# EasyEDA Pro project F103_RGB.eprj, board PCB1
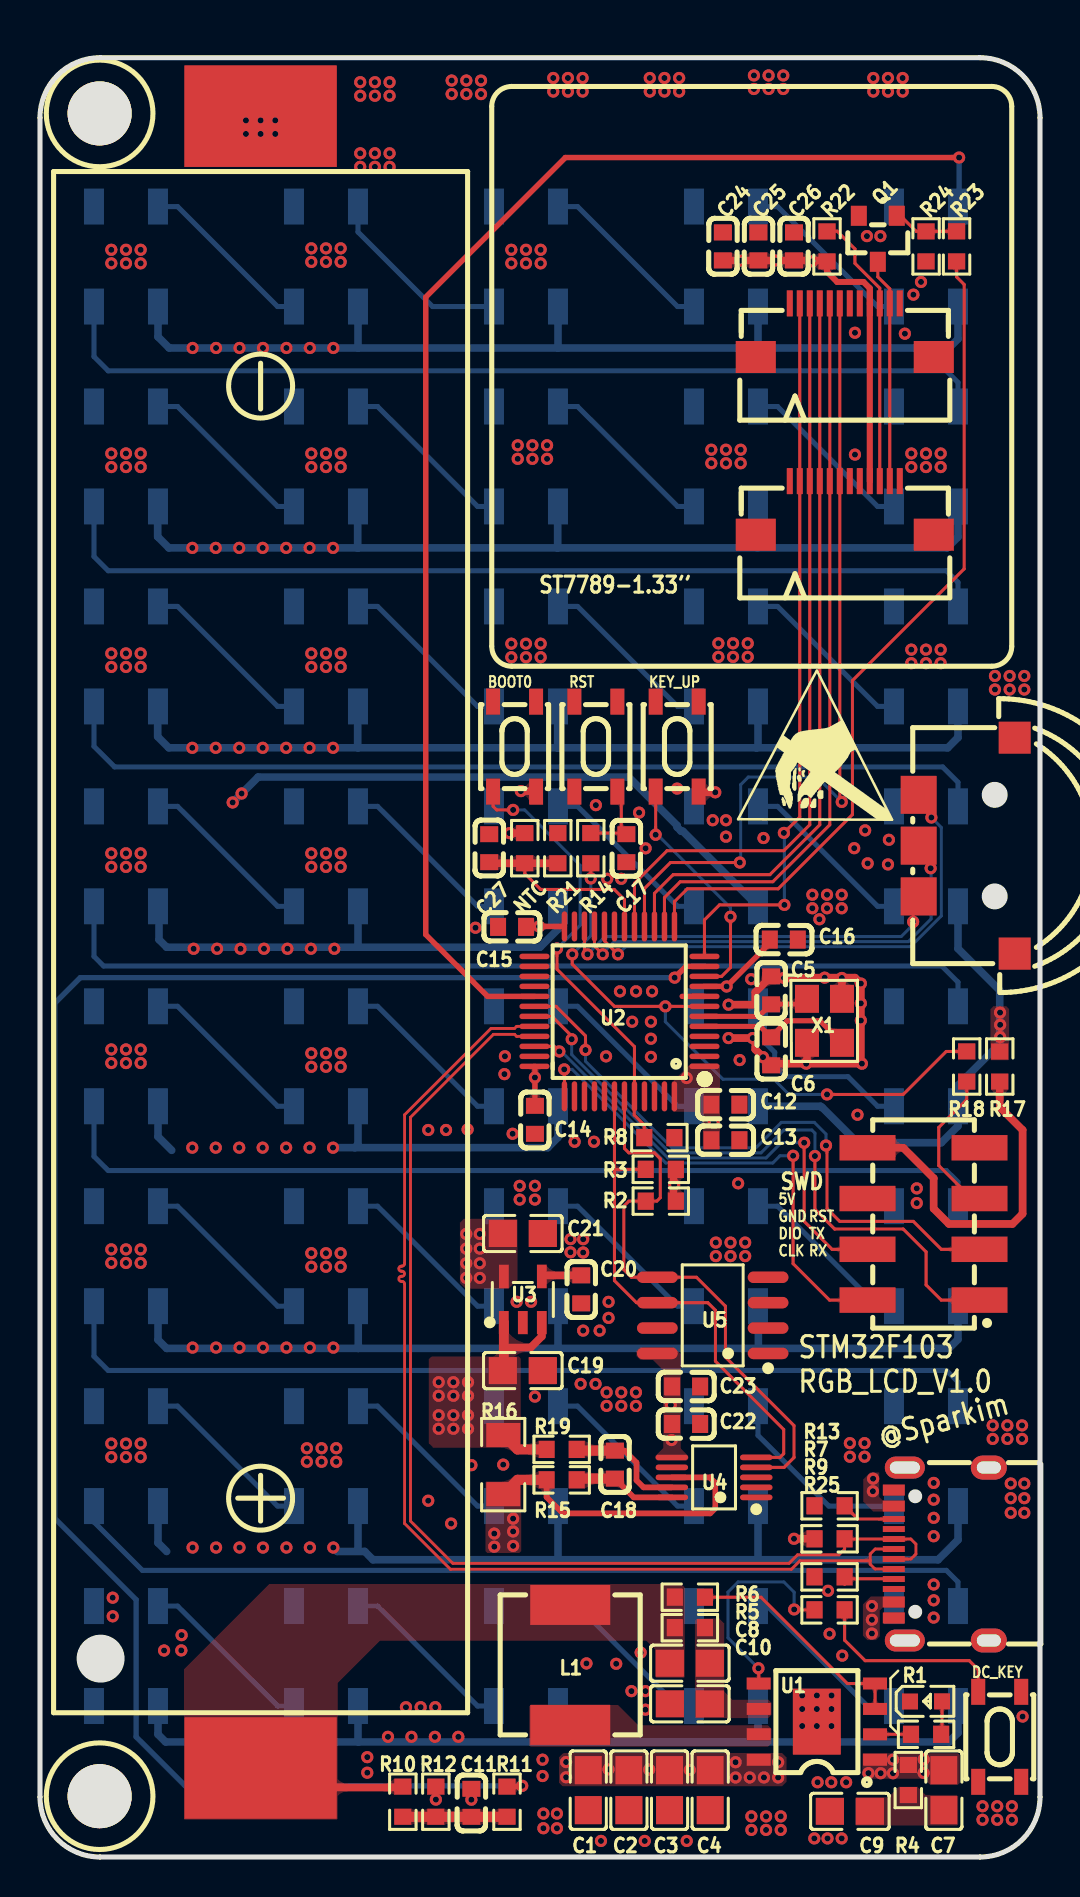
[diagram p1: board, top side]
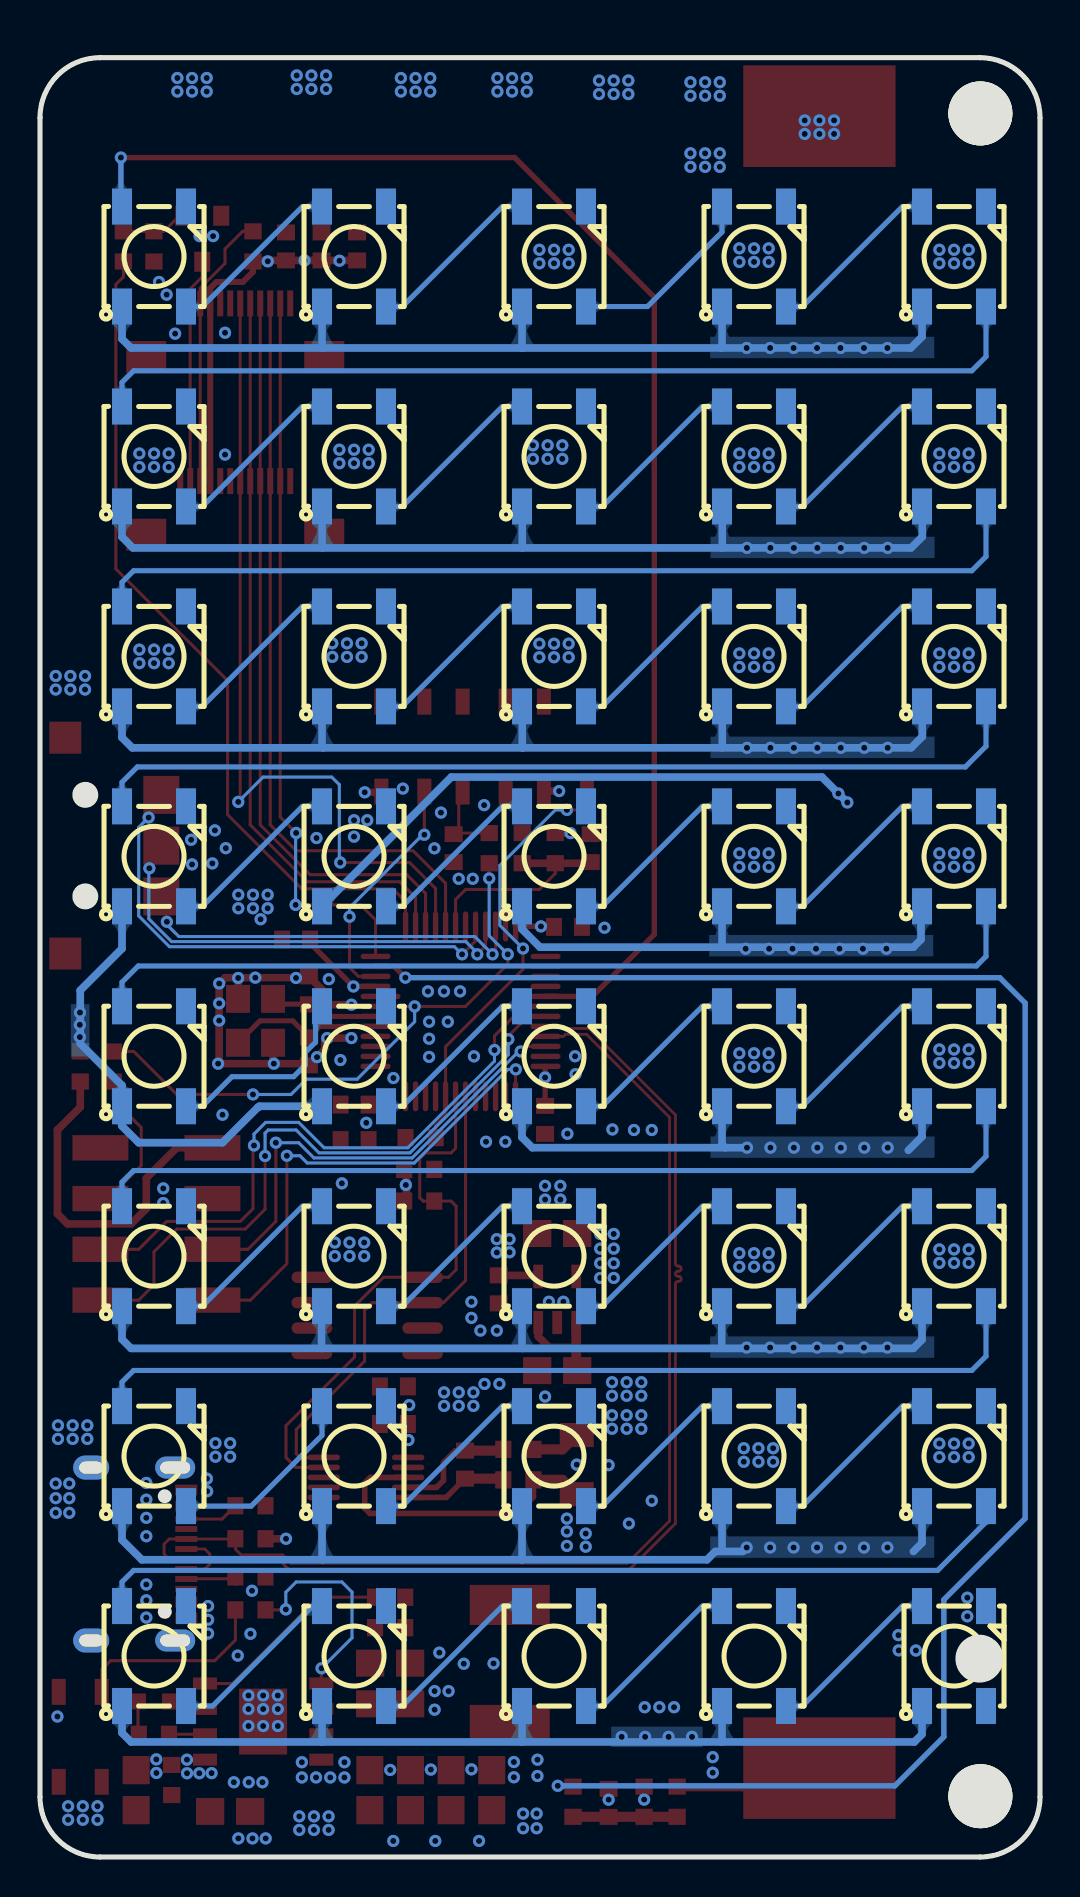
[diagram p2: board, bottom side, seen from below]

Outline 50 x 90 mm; copper layers: Top Layer, Inner1, Inner2, Bottom Layer. Coordinates in mm from the lower left corner of the outline.
Outline path: 0,87 0,3 arc(0.88,0.88) 3,0 47,0 arc(49.12,0.88) 50,3 50,87 arc(49.12,89.12) 47,90 3,90 arc(0.88,89.12) 0,87
Stack: Top Layer 0.035mm 外层铜厚1oz / Dielectric1 0.2104mm 7628 RC49% 8.6mil / Inner1 0.0152mm 内层铜厚 / Dielectric2 1.065mm 1.1mm H/HOZ Copper / Inner2 0.0152mm 内层铜厚 / Dielectric3 0.2104mm 7628 RC49% 8.6mil / Bottom Layer 0.035mm 外层铜厚1oz

## Design rules (mm)
net USB_DM: USB
net USB_DP: USB
template: 自定义配置
spacing copperThickness1oz (default): track to track 0.102, other pairs 0.152 to 0.3
spacing copperThickness2oz: track to track 0.203, other pairs 0.152 to 0.3
track width copperThickness1oz (default): min 0.127, default 0.152, max 2.54
track width copperThickness2oz: min 0.203, default 0.254, max 2.54
track width Power: min 0.127, default 0.381, max 2.54
differential pair differentialPair (default): width min 0.127, default 0.142, max 2.54; gap min 0.152, default 0.152
via viaSize (default): diameter min 0.5, default 0.61, max 10; hole min 0.3, default 0.305, max 6.299
net GND uses Power
net 5V uses Power
net BAT uses Power
net VBUS uses Power
net 3V3 uses Power
net 5V_VBUS uses Power

## Placement (name value [footprint] x y rotation side)
BT1  BH-18650-B1BA002  [BATTERY-SMD_18650-1S-L77.1-W20.7-1]  11.03 45.76 180 top
C1  22uF  [C0805]  27.41 3.34 90 top
C2  22uF  [C0805]  29.44 3.34 90 top
C3  22uF  [C0805]  31.48 3.34 90 top
C4  22uF  [C0805]  33.51 3.34 90 top
C5  22pF  [C0603]  36.56 43.35 90 top
C6  22pF  [C0603]  36.56 40.3 270 top
C7  10uF  [C0805]  45.19 3.34 90 top
C8  22uF  [C0805]  32.49 9.69 180 top
C9  10uF  [C0805]  40.49 2.28 0 top
C10  22uF  [C0805]  32.49 7.66 0 top
C11  100nF  [C0603]  21.57 2.71 90 top
C12  100nF  [C0603]  34.27 37.63 180 top
C13  100nF  [C0603]  34.27 35.86 180 top
C14  100nF  [C0603]  24.75 36.87 90 top
C15  100nF  [C0603]  23.6 46.52 0 top
C16  100nF  [C0603]  37.19 45.89 180 top
C17  100nF  [C0603]  29.32 50.46 90 top
C18  0.1uF  [C0603]  28.75 19.63 270 top
C19  1uF  [C0805]  24.14 24.33 180 top
C20  22nF  [C0603]  27.06 28.39 90 top
C21  1uF  [C0805]  24.14 31.19 180 top
C22  0.1uF  [C0603]  32.31 21.66 180 top
C23  100nF  [C0603]  32.31 23.54 180 top
C24  4.7uF  [C0603]  34.14 80.56 270 top
C25  100nF  [C0603]  35.92 80.56 270 top
C26  100nF  [C0603]  37.7 80.56 270 top
C27  100nF  [C0603]  22.46 50.46 270 top
FPC1  AFC01-S12FCA-00  [FPC-SMD_AFC01-S12FCA-00]  40.24 76.37 0 top
FPC2  AFC01-S12FCA-00  [FPC-SMD_AFC01-S12FCA-00]  40.24 67.48 0 top
H1  X6521WVS-2x04H-C60D74  [HDR-SMD_8P-P2.54-V-M-R2-C5-S7.4]  44.18 31.66 90 top
L1  1uH  [IND-SMD_L7.0-W7.0_HA63]  26.51 9.61 90 top
LED1  -  [LED_0603]  44.35 7.79 0 top
LED2  WS2812B-V5/W  [LED-SMD_4P-L5.0-W5.0-TL-1]  4.3 80.05 90 bottom
LED3  WS2812B-V5/W  [LED-SMD_4P-L5.0-W5.0-TL-1]  14.3 80.05 90 bottom
LED4  WS2812B-V5/W  [LED-SMD_4P-L5.0-W5.0-TL-1]  24.3 80.05 90 bottom
LED5  WS2812B-V5/W  [LED-SMD_4P-L5.0-W5.0-TL-1]  34.3 80.05 90 bottom
LED6  WS2812B-V5/W  [LED-SMD_4P-L5.0-W5.0-TL-1]  44.3 80.05 90 bottom
LED7  WS2812B-V5/W  [LED-SMD_4P-L5.0-W5.0-TL-1]  4.3 70.05 90 bottom
LED8  WS2812B-V5/W  [LED-SMD_4P-L5.0-W5.0-TL-1]  14.3 70.05 90 bottom
LED9  WS2812B-V5/W  [LED-SMD_4P-L5.0-W5.0-TL-1]  24.3 70.05 90 bottom
LED10  WS2812B-V5/W  [LED-SMD_4P-L5.0-W5.0-TL-1]  34.3 70.05 90 bottom
LED11  WS2812B-V5/W  [LED-SMD_4P-L5.0-W5.0-TL-1]  44.3 70.05 90 bottom
LED12  WS2812B-V5/W  [LED-SMD_4P-L5.0-W5.0-TL-1]  4.3 60.05 90 bottom
LED13  WS2812B-V5/W  [LED-SMD_4P-L5.0-W5.0-TL-1]  14.3 60.05 90 bottom
LED14  WS2812B-V5/W  [LED-SMD_4P-L5.0-W5.0-TL-1]  24.3 60.05 90 bottom
LED15  WS2812B-V5/W  [LED-SMD_4P-L5.0-W5.0-TL-1]  34.3 60.05 90 bottom
LED16  WS2812B-V5/W  [LED-SMD_4P-L5.0-W5.0-TL-1]  44.3 60.05 90 bottom
LED17  WS2812B-V5/W  [LED-SMD_4P-L5.0-W5.0-TL-1]  4.3 50.05 90 bottom
LED18  WS2812B-V5/W  [LED-SMD_4P-L5.0-W5.0-TL-1]  14.3 50.05 90 bottom
LED19  WS2812B-V5/W  [LED-SMD_4P-L5.0-W5.0-TL-1]  24.3 50.05 90 bottom
LED20  WS2812B-V5/W  [LED-SMD_4P-L5.0-W5.0-TL-1]  34.3 50.05 90 bottom
LED21  WS2812B-V5/W  [LED-SMD_4P-L5.0-W5.0-TL-1]  44.3 50.05 90 bottom
LED22  WS2812B-V5/W  [LED-SMD_4P-L5.0-W5.0-TL-1]  4.3 40.05 90 bottom
LED23  WS2812B-V5/W  [LED-SMD_4P-L5.0-W5.0-TL-1]  14.3 40.05 90 bottom
LED24  WS2812B-V5/W  [LED-SMD_4P-L5.0-W5.0-TL-1]  24.3 40.05 90 bottom
LED25  WS2812B-V5/W  [LED-SMD_4P-L5.0-W5.0-TL-1]  34.3 40.05 90 bottom
LED26  WS2812B-V5/W  [LED-SMD_4P-L5.0-W5.0-TL-1]  44.3 40.05 90 bottom
LED27  WS2812B-V5/W  [LED-SMD_4P-L5.0-W5.0-TL-1]  4.3 30.05 90 bottom
LED28  WS2812B-V5/W  [LED-SMD_4P-L5.0-W5.0-TL-1]  14.3 30.05 90 bottom
LED29  WS2812B-V5/W  [LED-SMD_4P-L5.0-W5.0-TL-1]  24.3 30.05 90 bottom
LED30  WS2812B-V5/W  [LED-SMD_4P-L5.0-W5.0-TL-1]  34.3 30.05 90 bottom
LED31  WS2812B-V5/W  [LED-SMD_4P-L5.0-W5.0-TL-1]  44.3 30.05 90 bottom
LED32  WS2812B-V5/W  [LED-SMD_4P-L5.0-W5.0-TL-1]  4.3 20.05 90 bottom
LED33  WS2812B-V5/W  [LED-SMD_4P-L5.0-W5.0-TL-1]  14.3 20.05 90 bottom
LED34  WS2812B-V5/W  [LED-SMD_4P-L5.0-W5.0-TL-1]  24.3 20.05 90 bottom
LED35  WS2812B-V5/W  [LED-SMD_4P-L5.0-W5.0-TL-1]  34.3 20.05 90 bottom
LED36  WS2812B-V5/W  [LED-SMD_4P-L5.0-W5.0-TL-1]  44.3 20.05 90 bottom
LED37  WS2812B-V5/W  [LED-SMD_4P-L5.0-W5.0-TL-1]  4.3 10.05 90 bottom
LED38  WS2812B-V5/W  [LED-SMD_4P-L5.0-W5.0-TL-1]  14.3 10.05 90 bottom
LED39  WS2812B-V5/W  [LED-SMD_4P-L5.0-W5.0-TL-1]  24.3 10.05 90 bottom
LED40  WS2812B-V5/W  [LED-SMD_4P-L5.0-W5.0-TL-1]  34.3 10.05 90 bottom
LED41  WS2812B-V5/W  [LED-SMD_4P-L5.0-W5.0-TL-1]  44.3 10.05 90 bottom
NTC  10K NTC  [R0603]  24.24 50.46 90 top
Q1  -  [S8050_SOT-23]  42.02 80.94 90 top
R1  10K  [R0603]  44.3 6.14 0 top
R2  4.7K  [R0603]  31.04 32.81 180 top
R3  4.7K  [R0603]  31.04 34.4 180 top
R4  2R  [R0603]  43.42 3.85 90 top
R5  0.5R  [R0603]  32.49 11.47 180 top
R6  1K  [R0603]  32.49 13 0 top
R7  1.5K  [R0603]  39.48 15.92 0 top
R8  10K  [R0603]  30.97 35.98 0 top
R9  5.1K  [R0603]  39.48 14.01 180 top
R10  100K 0.1%  [R0603]  18.14 2.77 90 top
R11  0R  [R0603]  23.35 2.77 90 top
R12  160K 0.1%  [R0603]  19.79 2.77 90 top
R13  5.1K  [R0603]  39.48 17.57 180 top
R14  10K  [R0603]  27.54 50.46 270 top
R15  10R  [R0603]  26.08 18.86 180 top
R16  100mR  [R1206]  23.16 19.63 270 top
R17  0R  [R0603]  47.99 39.54 270 top
R18  1K  [R0603]  46.34 39.54 90 top
R19  10R  [R0603]  26.08 20.39 180 top
R21  10K 0.1%  [R0603]  25.89 50.46 270 top
R22  10R  [R0603]  39.35 80.56 90 top
R23  2K  [R0603]  45.83 80.56 90 top
R24  100K  [R0603]  44.3 80.56 90 top
R25  10K  [R0603]  39.48 12.36 180 top
SW1  K2-1808SN-A3SW-01  [SW-SMD_4P-L4.2-W3.3-P2.15-LS5.1]  23.73 55.54 270 top
SW2  K2-1808SN-A3SW-01  [SW-SMD_4P-L4.2-W3.3-P2.15-LS5.1]  27.79 55.54 270 top
SW3  K1-1502SA-01  [KEY-SMD_K1-1502SA-01]  46.34 50.59 270 top
SW4  K2-1808SN-A3SW-01  [SW-SMD_4P-L4.2-W3.3-P2.15-LS5.1]  31.86 55.54 270 top
SW5  K2-1808SN-A3SW-01  [SW-SMD_4P-L4.2-W3.3-P2.15-LS5.1]  47.99 6.01 90 top
TP1  M3铜柱  [M3铜柱_LCEDA]  2.98 3.04 0 top
TP2  M3铜柱  [M3铜柱_LCEDA]  2.98 87.21 0 top
U1  IP5306  [ESOP-8_L4.9-W3.9-P1.27-LS6.0-BL-EP]  38.84 6.77 90 top
U2  STM32F103C8T6  [LQFP-48_L7.0-W7.0-P0.50-LS9.0-BL]  28.97 42.3 90 top
U3  RT9193-33GB  [SOT-23-5_L3.0-W1.7-P0.95-LS2.8-BL]  24.14 27.88 0 top
U4  INA226AIDGSR  [MSOP-10_L3.0-W3.0-P0.50-LS5.0-BL]  33.7 18.99 90 top
U5  AT24C02  [SOP-8_L5.0-W4.0-P1.27-LS6.0-BL]  33.64 27.09 90 top
U6  -  [禁止触摸LOGO]  38.84 54.78 0 top
USB1  TYPE-C 16PIN 2MD(073)  [USB-C-SMD_TYPE-C-6PIN-2MD-073]  45.07 15.16 90 top
X1  8MHz  [OSC-SMD_4P-L3.2-W2.5-BL]  39.22 41.82 270 top

## Footprints (pads in the part's own frame, mm; a bottom-side part is the same pattern mirrored in y, then rotated)
BATTERY-SMD_18650-1S-L77.1-W20.7-1
  rect 7.62x5.08 smd: 1(0,-41.313) 2(0,41.313)
C0603
  rect 0.8x0.9 smd: 1(-0.7,0) 2(0.7,0)
C0805
  rect 1.41x1.35 smd: 1(-1,0) 2(1,0)
ESOP-8_L4.9-W3.9-P1.27-LS6.0-BL-EP
  rect 0.6x1.2 smd: 1(-1.905,-2.909) 2(-0.635,-2.909) 3(0.635,-2.909) 4(1.905,-2.909) 5(1.905,2.909) 6(0.635,2.909) 7(-0.635,2.909) 8(-1.905,2.909)
  rect 3.3x2.4 smd: 9(0,0)
FPC-SMD_AFC01-S12FCA-00
  rect 0.3x1.3 smd: 1(-2.751,1.341) 2(-2.251,1.341) 3(-1.751,1.341) 4(-1.25,1.341) 5(-0.75,1.341) 6(-0.249,1.341) 7(0.251,1.341) 8(0.75,1.341) 9(1.249,1.341) 10(1.75,1.341) 11(2.249,1.341) 12(2.75,1.341)
  rect 2x1.6 smd: 13(-4.45,-1.34) 14(4.45,-1.341)
HDR-SMD_8P-P2.54-V-M-R2-C5-S7.4
  rect 1.27x2.8 smd: 1(-3.81,-2.8) 2(-3.81,2.8) 3(-1.27,-2.8) 4(-1.27,2.8) 5(1.27,-2.8) 6(1.27,2.8) 7(3.81,-2.8) 8(3.81,2.8)
IND-SMD_L7.0-W7.0_HA63
  rect 2x4 smd: 1(-3,0) 2(3,0)
KEY-SMD_K1-1502SA-01
  rect 1.9x1.8 smd: 1(-2.54,-2.4) 2(2.54,-2.4) T(0,-2.4)
  rect 1.6x1.6 smd: 5(-5.4,2.4) C(5.4,2.4)
LED-SMD_4P-L5.0-W5.0-TL-1
  rect 1.8x1 smd: 1(-2.5,1.6) 2(-2.5,-1.6) 3(2.5,-1.6) 4(2.5,1.6)
LED_0603
  rect 0.8x0.8 smd: 1(-0.851,-0.01) 2(0.75,-0.005)
LQFP-48_L7.0-W7.0-P0.50-LS9.0-BL
  oval 0.27x1.5 smd: 1(-2.75,-4.25) 2(-2.25,-4.25) 3(-1.75,-4.25) 4(-1.25,-4.25) 5(-0.75,-4.25) 6(-0.25,-4.25) 7(0.25,-4.25) 8(0.75,-4.25) 9(1.25,-4.25) 10(1.75,-4.25) 11(2.25,-4.25) 12(2.75,-4.25) 25(2.75,4.25) 26(2.25,4.25) 27(1.75,4.25) 28(1.25,4.25) 29(0.75,4.25) 30(0.25,4.25) 31(-0.25,4.25) 32(-0.75,4.25) 33(-1.25,4.25) 34(-1.75,4.25) 35(-2.25,4.25) 36(-2.75,4.25)
  oval 1.5x0.27 smd: 13(4.25,-2.75) 14(4.25,-2.25) 15(4.25,-1.75) 16(4.25,-1.25) 17(4.25,-0.75) 18(4.25,-0.25) 19(4.25,0.25) 20(4.25,0.75) 21(4.25,1.25) 22(4.25,1.75) 23(4.25,2.25) 24(4.25,2.75) 37(-4.25,2.75) 38(-4.25,2.25) 39(-4.25,1.75) 40(-4.25,1.25) 41(-4.25,0.75) 42(-4.25,0.25) 43(-4.25,-0.25) 44(-4.25,-0.75) 45(-4.25,-1.25) 46(-4.25,-1.75) 47(-4.25,-2.25) 48(-4.25,-2.75)
M3铜柱_LCEDA
  round 3.2 hole 3.2: 1(0,0)
MSOP-10_L3.0-W3.0-P0.50-LS5.0-BL
  oval 0.28x1.62 smd: 1(-1,-2.11) 2(-0.5,-2.11) 3(0,-2.11) 4(0.5,-2.11) 5(1,-2.11) 6(1,2.11) 7(0.5,2.11) 8(0,2.11) 9(-0.5,2.11) 10(-1,2.11)
OSC-SMD_4P-L3.2-W2.5-BL
  rect 1.4x1.2 smd: 1(-1.1,-0.875) 2(1.1,-0.875) 3(1.1,0.875) 4(-1.1,0.875)
R0603
  rect 0.806x0.864 smd: 1(-0.753,0) 2(0.753,0)
R1206
  rect 1.208x1.701 smd: 1(-1.479,0) 2(1.479,0)
S8050_SOT-23
  rect 1x0.8 smd: 1(1.15,-0.823) 2(1.15,1.077) 3(-1.15,0.127)
SOP-8_L5.0-W4.0-P1.27-LS6.0-BL
  oval 0.574x2.035 smd: 1(-1.905,-2.768) 2(-0.635,-2.768) 3(0.635,-2.768) 4(1.905,-2.768) 5(1.905,2.768) 6(0.635,2.768) 7(-0.635,2.768) 8(-1.905,2.768)
SOT-23-5_L3.0-W1.7-P0.95-LS2.8-BL
  rect 0.49x1.157 smd: 1(-0.95,-1.153) 2(0,-1.153) 3(0.95,-1.153)
  rect 0.49x1.175 smd: 4(0.95,1.153) 5(-0.95,1.153)
SW-SMD_4P-L4.2-W3.3-P2.15-LS5.1
  rect 1.3x0.7 smd: 1(-2.25,1.075) 2(2.25,1.075) 3(-2.25,-1.075) 4(2.25,-1.075)
USB-C-SMD_TYPE-C-6PIN-2MD-073
  rect 0.55x1.1 smd: 1(-3.2,2.375) 2(-2.4,2.375) 11(2.4,2.375) 12(3.2,2.375)
  rect 0.3x1.1 smd: 3(-1.75,2.375) 4(-1.25,2.375) 5(-0.75,2.375) 6(-0.25,2.375) 7(0.25,2.375) 8(0.75,2.375) 9(1.25,2.375) 10(1.75,2.375)
  oval 1.1x2 hole 0.6x1.5: 13(-4.325,1.825) 14(4.325,1.825)
  oval 1.2x1.8 hole 0.6x1.2: 13(-4.325,-2.375) 14(4.325,-2.375)

## Nets
As in the schematic.

Pads without a net: H1 7; LED37 2; SW1 1 3; SW2 1 3; SW4 1 3; SW5 1 3; U2 2 3 4 25 26 27 28 38 39 40 41 45 46; USB1 3 9

## Via types
v1: diameter 0.61, hole 0.305, Top Layer to Bottom Layer, 509 vias

## Routing (per net, layer and track width the routed paths; a pad name or vN(x,y) marks a point on that pad's centre or on a via; arc(x,y) is an arc through that point)
3V3: length 31.1
  Top Layer w0.269: U2.9 34.33,43.55 v1(34.33,43.54) 36.49,45.7 C16.2 ; U2.24 v1(24.95,46.55) 24.33,46.55 C15.2 ; U2.36 24.75,39.52 v1(24.75,38.99) C14.2
  Top Layer w0.299: FPC2.9 FPC1.9 41.49,78.47 41.17,78.78 39.86,78.78 39.35,79.29 39.35,79.67
  Top Layer w0.381: v1(33.76,53.25) 32.97,53.25 SW4.2 ; SW1.2 24.78,53.32 v1(24.04,53.32) ; v1(37.7,15.92) R7.1 ; 31.85,32.77 31.68,32.94 31.68,34.38 ; C24.2 C25.2 C26.2 39.3,79.86 R22.1 ; v1(23.48,51.21) NTC.2
  vias: v1(21.31,31.16) v1(21.31,30.43) v1(21.31,29.7) v1(21.31,28.96) v1(21.99,31.16) v1(21.99,30.43) v1(21.99,29.7) v1(21.99,28.96) v1(31.54,22.6) v1(31.58,20.86) v1(31.71,33.62) v1(32.33,38.96) v1(33.69,36.72) v1(35.03,79.84) v1(36.77,79.85) v1(38.61,79.81)
5V: length 395.5
  Top Layer w0.381: U3.3 25.09,26.04 24.54,25.49 23.19,25.49
  Top Layer w0.49: C19.2 23.19,24.38 U3.1
  Top Layer w0.508: 23.16,21.1 23.88,20.39 R19.2
  Bottom Layer w0.381: LED33.1 15.9,15.41 ; 15.73,35.48 15.9,35.64 LED23.1 ; 15.73,35.48 v1(14.65,35.48) ; 15.73,35.48 25.39,35.48 25.9,35.99 LED24.1 ; 35.87,65.48 25.87,65.48 ; 35.87,65.48 35.9,65.51 LED10.1 ; 35.87,65.48 45.35,65.48 45.9,66.03 LED11.1 ; 25.87,65.48 15.9,65.48 ; 25.87,65.48 25.88,65.49 25.88,67.55 ; 25.87,25.44 25.9,25.47 LED29.1 ; 25.87,25.44 35.92,25.44 ; 25.87,25.44 15.91,25.44 ; LED25.1 39.03,37.55 39.08,37.49 39.11,37.49 40.88,35.73 45.07,35.73 45.9,36.56 LED26.1 45.9,38.59 47.99,40.68 47.99,43.35 45.9,45.44 LED21.1 ; 35.92,25.44 35.92,27.53 LED30.1 ; 35.92,25.44 45.45,25.44 45.9,25.89 LED31.1 ; v1(9.63,52.75) v1(10.08,53.19) 10.9,54.02 29.43,54.02 31.86,51.59 31.86,51.51 32.06,51.31 32.14,51.31 LED20.1 ; 35.88,5.76 45.45,5.76 45.9,6.21 LED41.1 ; 35.88,5.76 25.91,5.76 ; 35.88,5.76 35.9,5.77 LED40.1 ; 25.88,57.55 25.88,55.49 25.87,55.48 ; 25.91,5.76 15.92,5.76 ; 25.91,5.76 25.9,5.77 LED39.1 ; 15.92,5.76 15.9,5.78 LED38.1 ; 15.92,5.76 6.28,5.76 5.9,6.14 LED37.1 ; LED19.1 25.9,46.41 25,45.51 15.95,45.51 ; 25.87,55.48 15.9,55.48 ; 25.87,55.48 35.83,55.48 ; 15.91,25.44 15.91,27.54 LED28.1 ; 15.91,25.44 6.33,25.44 5.9,25.87 LED27.1 ; LED34.1 25.9,14.88 25.88,14.87 ; 15.95,45.51 6.33,45.51 5.95,45.89 5.95,47.5 LED17.1 ; 15.95,45.51 15.9,45.56 LED18.1 ; LED15.1 35.9,55.55 35.83,55.48 ; 5.88,57.55 5.88,56.04 6.44,55.48 v1(7.62,55.48) v1(8.79,55.48) v1(9.96,55.48) v1(11.13,55.48) v1(12.31,55.48) v1(13.48,55.48) v1(14.65,55.48) 15.9,55.48 ; LED6.1 45.9,75.93 45.45,75.48 35.86,75.48 ; 25.89,75.48 15.91,75.48 ; 25.89,75.48 35.86,75.48 ; 25.89,75.48 25.9,75.49 LED4.1 ; 15.91,75.48 15.9,75.49 LED3.1 ; 15.91,75.48 v1(14.67,75.48) v1(13.49,75.48) v1(12.32,75.48) v1(8.8,75.48) v1(7.63,75.48) 6.46,75.48 5.9,76.04 LED2.1 ; 15.9,65.48 15.88,65.49 15.88,67.55 ; 15.9,65.48 v1(14.65,65.48) v1(13.48,65.48) v1(12.31,65.48) v1(11.13,65.48) v1(9.96,65.48) v1(8.79,65.48) v1(7.62,65.48) 6.44,65.48 5.88,66.04 5.88,67.55 ; 35.86,75.48 35.9,75.52 LED5.1 ; LED22.1 5.9,36.03 6.59,35.35 ; 6.33,15.28 5.9,15.71 LED32.1 ; 25.88,14.87 16.65,14.87 16.24,15.28 14.86,15.28 v1(14.67,15.48) ; 25.88,14.87 35.87,14.87 ; LED16.1 45.9,55.99 45.39,55.48 35.83,55.48 ; 35.87,14.87 44.91,14.87 45.9,15.86 LED36.1 ; 35.87,14.87 35.9,14.89 LED35.1 ; 15.88,57.55 15.88,55.49 15.9,55.48
  vias: v1(7.62,35.48) v1(7.63,25.48) v1(7.63,15.48) v1(7.68,45.43) v1(8.79,35.48) v1(8.8,25.48) v1(8.8,15.48) v1(8.85,45.43) v1(9.98,75.48) v1(10.03,45.43) v1(9.96,35.48) v1(9.98,25.48) v1(9.98,15.48) v1(11.15,75.48) v1(11.13,35.48) v1(11.15,25.48) v1(11.15,15.48) v1(11.2,45.43) v1(12.31,35.48) v1(12.32,25.48) v1(12.32,15.48) v1(12.37,45.43) v1(13.55,45.43) v1(13.48,35.48) v1(13.49,25.48) v1(13.49,15.48) v1(14.72,45.43) v1(14.67,25.48) v1(17.4,6.01) v1(18.57,6.01) v1(19.74,6.01) v1(19.93,23.75) v1(19.93,23.07) v1(19.93,22.1) v1(19.93,21.42) v1(20.67,23.75) v1(20.67,23.07) v1(20.67,22.1) v1(20.67,21.42) v1(20.92,6.01) v1(21.4,23.75) v1(21.4,23.07) v1(21.4,22.1) v1(21.4,21.42) v1(48,42.24) v1(48.01,41.63) v1(48.01,41.01)
5V_VBUS: length 15.8
  Top Layer w0.28: R15.2 25.33,18 26.14,17.19 33.51,17.19 33.76,17.44 33.76,18.71 33.49,18.99 U4.8
  Top Layer w0.508: R16.2 23.88,18.86 R15.2
  vias: v1(22.71,16.18) v1(22.71,15.52) v1(23.66,16.92) v1(23.66,16.28) v1(23.66,15.56) v1(26.31,4.75) v1(26.31,3.99) v1(28.43,4.38) v1(30.46,4.37) v1(32.49,4.35) v1(34.78,4.74) v1(34.78,3.98) v1(35.49,3.98) v1(36.2,3.98) v1(36.91,4.74) v1(36.91,3.98)
GND: length 22.5
  Top Layer w0.269: U2.8 32.11,43.05
  Top Layer w0.381: v1(34.43,42.63) 35.76,42.63 35.76,43.26 C5.2 36.64,43.97 v1(37.2,43.97) 37.22,43.98 v1(39.24,43.98) 40.08,43.98 v1(40.09,43.97) ; v1(40.09,43.97) 40.1,43.96 X1.4 ; v1(40.09,43.97) 40.11,43.98 40.75,43.98 v1(41.04,43.69) v1(41.04,42.7) v1(41.04,41.84) 41.04,39.73 v1(41.09,39.68) v1(38.31,39.68) ; v1(34.43,40.96) v1(35.64,40.96) 35.76,40.84 35.76,40.39 v1(36.15,40.01) C6.2 36.64,39.68 v1(38.31,39.68) ; X1.2 38.35,39.72 v1(38.31,39.68)
  vias: v1(3.57,80.39) v1(3.57,79.71) v1(3.57,70.2) v1(3.57,69.52) v1(3.57,60.2) v1(3.57,59.52) v1(3.57,50.2) v1(3.57,49.52) v1(3.57,40.39) v1(3.57,39.71) v1(3.57,30.39) v1(3.57,29.71) v1(3.57,20.68) v1(3.57,20) v1(3.64,12.97) v1(3.64,12.04) v1(4.3,80.39) v1(4.3,79.71) v1(4.3,70.2) v1(4.3,69.52) v1(4.3,60.2) v1(4.3,59.52) v1(4.3,50.2) v1(4.3,49.52) v1(4.3,40.39) v1(4.3,39.71) v1(4.3,30.39) v1(4.3,29.71) v1(4.3,20.68) v1(4.3,20) v1(5.03,80.39) v1(5.03,79.71) v1(5.03,70.2) v1(5.03,69.52) v1(5.03,60.2) v1(5.03,59.52) v1(5.03,50.2) v1(5.03,49.52) v1(5.03,40.39) v1(5.03,39.71) v1(5.03,30.39) v1(5.03,29.71) v1(5.03,20.68) v1(5.03,20) v1(6.2,10.33) v1(7.08,11.1) v1(7.06,10.33) v1(10.3,86.86) v1(10.3,86.19) v1(11.03,86.86) v1(11.03,86.19) v1(11.76,86.86) v1(11.76,86.19) v1(13.34,20.45) v1(13.34,19.77) v1(13.57,80.46) v1(13.57,79.78) v1(13.57,70.2) v1(13.57,69.52) v1(13.57,60.2) v1(13.57,59.52) v1(13.57,50.2) v1(13.57,49.52) v1(13.57,40.2) v1(13.57,39.52) v1(13.57,30.2) v1(13.57,29.52) v1(14.08,20.45) v1(14.08,19.77) v1(14.3,80.46) v1(14.3,79.78) v1(14.3,70.2) v1(14.3,69.52) v1(14.3,60.2) v1(14.3,59.52) v1(14.3,50.2) v1(14.3,49.52) v1(14.3,40.2) v1(14.3,39.52) v1(14.3,30.2) v1(14.3,29.52) v1(14.81,20.45) v1(14.81,19.77) v1(15.03,80.46) v1(15.03,79.78) v1(15.03,70.2) v1(15.03,69.52) v1(15.03,60.2) v1(15.03,59.52) v1(15.03,50.2) v1(15.03,49.52) v1(15.03,40.2) v1(15.03,39.52) v1(15.03,30.2) v1(15.03,29.52) v1(16.01,88.77) v1(16.01,88.1) v1(16.01,85.22) v1(16.01,84.54) v1(16.36,5) v1(16.36,4.22) v1(16.75,88.77) v1(16.75,88.1) v1(16.75,85.22) v1(16.75,84.54) v1(17.48,88.77) v1(17.48,88.1) v1(17.48,85.22) v1(17.48,84.54) v1(18.3,7.49) v1(19.03,7.49) v1(19.41,36.36) v1(19.41,17.82) v1(19.76,7.49) v1(19.79,2.87) v1(20.3,36.36) v1(20.58,88.86) v1(20.58,88.18) v1(20.56,16.68) v1(21.32,88.86) v1(21.32,88.18) v1(21.38,36.39) v1(21.57,19.6) v1(21.57,2.87) v1(21.78,46.48) v1(22.05,88.86) v1(22.05,88.18) v1(23.25,40.05) v1(23.22,39.16) v1(23.16,19.63) v1(23.57,80.39) v1(23.57,79.71) v1(23.57,60.69) v1(23.57,60.01) v1(23.63,36.18) v1(23.83,27.77) v1(23.89,70.61) v1(23.89,69.93) v1(23.98,33.57) v1(23.98,32.89) v1(24.3,80.39) v1(24.3,79.71) v1(24.3,60.69) v1(24.3,60.01) v1(24.62,70.61) v1(24.62,69.93) v1(24.55,27.77) v1(24.75,33.57) v1(24.75,32.89) v1(24.75,23.03) v1(25.03,80.39) v1(25.03,79.71) v1(25.03,60.69) v1(25.03,60.01) v1(25.13,4.87) v1(25.13,4.05) v1(25.17,2.17) v1(25.17,1.44) v1(25.35,70.61) v1(25.35,69.93) v1(25.66,88.98) v1(25.66,88.31) v1(25.85,2.17) v1(25.85,1.44) v1(26.4,88.98) v1(26.4,88.31) v1(26.52,30.9) v1(26.52,30.25) v1(26.73,35.78) v1(27.03,23.66) v1(27.13,88.98) v1(27.13,88.31) v1(27.16,30.9) v1(27.16,30.24) v1(27.16,26.33) v1(27.32,9.68) v1(27.7,35.78) v1(27.79,52.61) v1(27.78,23.66) v1(27.98,26.33) v1(28.05,0.8) v1(28.3,40.05) v1(28.33,23.24) v1(28.33,22.56) v1(28.36,48.93) v1(28.43,27.77) v1(28.43,26.97) v1(28.81,9.67) v1(29,43.3) v1(29.06,48.93) v1(29.06,23.24) v1(29.06,22.56) v1(29.61,41.78) v1(29.57,8.3) v1(29.8,43.3) v1(29.8,23.24) v1(29.8,22.56) v1(29.95,52.24) v1(30.03,10.22) v1(30.24,0.8) v1(30.28,50.45) v1(30.27,8.3) v1(30.27,7.37) v1(30.49,88.98) v1(30.49,88.31) v1(30.55,41.78) v1(30.55,40.93) v1(30.55,40.02) v1(30.6,43.3) v1(31.22,88.98) v1(31.22,88.31) v1(31.86,53.44) v1(31.96,88.98) v1(31.96,88.31) v1(32.34,0.8) v1(33.57,70.39) v1(33.57,69.71) v1(33.64,51.86) v1(33.79,30.73) v1(33.79,30.06) v1(33.92,60.71) v1(33.92,60.03) v1(34.3,70.39) v1(34.3,69.71) v1(34.3,51.86) v1(34.3,51.04) v1(34.53,30.73) v1(34.53,30.06) v1(34.65,60.71) v1(34.65,60.03) v1(34.91,33.7) v1(35.03,70.39) v1(35.03,69.71) v1(34.98,39.86) v1(35.26,30.73) v1(35.26,30.06) v1(35.39,60.71) v1(35.39,60.03) v1(35.56,43.91) v1(35.57,2.03) v1(35.57,1.35) v1(35.7,89.11) v1(35.7,88.43) v1(36.18,50.97) v1(36.3,2.03) v1(36.3,1.35) v1(36.43,89.11) v1(36.43,88.43) v1(37.04,2.03) v1(37.04,1.35) v1(37.16,89.11) v1(37.16,88.43) v1(38.11,8.08) v1(38.11,7.4) v1(38.11,6.55) v1(38.62,48.13) v1(38.62,47.46) v1(38.72,0.93) v1(38.84,8.08) v1(38.84,7.4) v1(38.84,6.55) v1(38.88,3.74) v1(38.97,46.9) v1(39.35,48.13) v1(39.35,47.46) v1(39.4,13.32) v1(39.38,0.93) v1(39.48,11.16) v1(39.58,8.08) v1(39.58,7.4) v1(39.58,6.55) v1(39.56,3.74) v1(40.08,48.13) v1(40.08,47.46) v1(40.11,10.07) v1(40.08,0.93) v1(40.31,3.74) v1(40.49,20.7) v1(40.49,20.02) v1(40.75,76.24) v1(40.75,70.15) v1(40.71,50.46) v1(40.88,37.13) v1(41.23,20.7) v1(41.23,20.02) v1(41.35,81.07) v1(41.26,51.35) v1(41.38,49.7) v1(41.67,88.98) v1(41.67,88.31) v1(42.02,81.07) v1(42.4,88.98) v1(42.4,88.31) v1(42.44,50.88) v1(42.4,49.65) v1(43.13,88.98) v1(43.13,88.31) v1(43.24,76.19) v1(43.57,70.2) v1(43.57,69.52) v1(43.57,60.39) v1(43.57,59.71) v1(43.67,78.15) v1(43.84,33.44) v1(43.84,32.71) v1(44.05,78.78) v1(44.3,70.2) v1(44.3,69.52) v1(44.3,60.39) v1(44.3,59.71) v1(44.69,18.71) v1(44.69,17.87) v1(44.69,16.97) v1(44.69,16.04) v1(44.69,13.63) v1(44.69,12.84) v1(44.69,11.98) v1(45.03,70.2) v1(45.03,69.52) v1(45.03,60.39) v1(45.03,59.71) v1(47.13,2.54) v1(47.13,1.86) v1(47.63,21.59) v1(47.63,20.91) v1(47.75,59.07) v1(47.75,58.4) v1(47.86,2.54) v1(47.86,1.86) v1(48.37,21.59) v1(48.37,20.91) v1(48.48,59.07) v1(48.48,58.4) v1(48.54,18.68) v1(48.54,17.95) v1(48.54,17.22) v1(48.59,2.54) v1(48.59,1.86) v1(49.1,21.59) v1(49.1,20.91) v1(49.13,7.03) v1(49.22,59.07) v1(49.22,58.4) v1(49.21,18.68) v1(49.21,17.95) v1(49.21,17.22)
VBUS:
  vias: v1(41.42,4.2) v1(41.64,18.3) v1(41.6,12.55) v1(41.6,11.87) v1(41.6,11.18) v1(41.65,18.92) v1(42.04,4.19) v1(42.65,4.19) v1(42.65,4.87) v1(44.19,4.88) v1(44.18,4.2)
ADC1_IN8: length 10.8
  Top Layer w0.152: NTC.1 24.24,49.19 25.03,48.4 28.72,48.4 29.22,47.89 U2.18
  Top Layer w0.381: C27.2 22.51,49.71 NTC.1 R21.2
ADC2_IN1: length 92.7
  Top Layer w0.269: v1(24.11,3.56) 24.07,3.52 R11.2 ; U2.11 32.29,44.55 v1(31.73,43.98)
  Bottom Layer w0.269: v1(31.73,43.98) 2.01,43.98 0.74,42.71 0.74,16.93 4.81,12.87 4.81,6.01 7.26,3.56 v1(24.11,3.56)
AT_SCL: length 26.5
  Top Layer w0.152: U4.5 37,19.99 37.18,20.17 37.18,21.39 33.77,24.8 33.77,27.35 33.39,27.73 U5.6 29.83,27.73 28.72,28.83 28.72,34.39 ; 28.72,34.39 30.29,34.39 ; 28.72,34.39 U2.42
AT_SDA: length 28.6
  Top Layer w0.152: U2.43 29.22,35.44 29.44,35.22 30.72,35.22 31.01,34.92 31.01,32.98 30.84,32.81 R2.2 29.44,32.81 29.19,32.55 29.19,29.38 29.57,29 U5.5 32.83,29 34.27,27.55 34.27,25.01 37.7,21.58 37.7,19.98 37.21,19.49 U4.4
BAT: length 4.8
  Top Layer w0.381: 13.35,3.53 13.41,3.48 18.16,3.48
BOOT0: length 21.6
  Top Layer w0.152: R8.1 30.22,36.61 29.71,37.11 29.71,37.41 ; U2.44 29.72,40.53 25.85,44.4 v1(25.85,45.44) ; SW1.4 22.66,52.55 22.83,52.37 v1(23.66,52.37)
  Bottom Layer w0.152: v1(25.85,45.44) 27.01,46.6 27.01,49.6 24.23,52.37 v1(23.66,52.37)
C_CC1: length 2.7
  Top Layer w0.152: 40.23,13.63 40.23,13.91 40.24,13.92 42.68,13.92 USB1.4
C_CC2: length 2.7
  Top Layer w0.152: USB1.10 40.89,16.91 R13.1
IO1: length 47.4
  Bottom Layer w0.254: LED11.4 45.9,73.76 45.32,74.34 3.41,74.34 2.7,75.05 LED2.2
IO2: length 47.4
  Bottom Layer w0.254: LED7.2 2.7,65.05 3.41,64.34 45.32,64.34 45.9,63.76 LED16.4
IO3: length 47.1
  Bottom Layer w0.254: LED21.4 45.9,53.76 45.13,54.52 3.73,54.52 2.7,55.56 LED12.2
IO4: length 47.4
  Bottom Layer w0.254: LED26.4 45.9,43.76 45.09,44.57 3.18,44.57 2.7,45.05 LED17.2
IO5: length 47.4
  Bottom Layer w0.254: LED31.4 45.9,33.76 45.32,34.34 3.41,34.34 2.7,35.05 LED22.2
IO6: length 47.4
  Bottom Layer w0.254: LED36.4 45.9,23.76 45.32,24.34 3.41,24.34 2.7,25.05 LED27.2
IO7: length 46.4
  Bottom Layer w0.254: LED41.4 45.9,13.76 45.32,14.34 5.12,14.34 2.7,16.75 LED32.2
KEY_0: length 23.8
  Top Layer w0.152: v1(28.9,45.15) 28.89,45.15 28.22,45.82 U2.20
  Bottom Layer w0.152: v1(28.9,45.15) 29.28,45.53 43.53,45.53 45.07,47.07 45.07,51.5 v1(44.57,51.99)
KEY_1: length 21.3
  Top Layer w0.152: v1(28.14,45.15) 27.72,45.57 U2.21
  Bottom Layer w0.152: v1(28.14,45.15) 28.14,45.22 28.71,45.79 43.42,45.79 44.56,46.93 44.56,49.43 v1(44.53,49.45)
KEY_2: length 19.9
  Top Layer w0.152: v1(27.37,45.15) 27.22,45.3 U2.22 ; SW3.2 43.66,47.77 v1(43.66,46.78)
  Bottom Layer w0.152: v1(27.37,45.15) 28.26,46.04 43.06,46.04 43.66,46.64 v1(43.66,46.78)
KEY_UP: length 11.9
  Top Layer w0.152: v1(34.53,47.03) 34.53,44.49 34.08,44.05 U2.10 ; v1(30.78,51.13) SW4.4
  Bottom Layer w0.152: v1(30.78,51.13) 30.87,51.13 34.53,47.48 v1(34.53,47.03)
LCD_BL: length 42.1
  Top Layer w0.152: U2.13 31.72,47.79 32.37,48.43 36.91,48.43 40.62,52.14 40.62,58.84 46.21,64.43 46.21,78.65 45.83,79.04 R23.1
LCD_CS: length 37.3
  Top Layer w0.152: FPC1.5 39.49,51.63 36.64,48.78 32.01,48.78 31.22,47.99 U2.14
LCD_LEDA: length 13.9
  Top Layer w0.152: R22.2 39.36,81.32 39.86,81.32 40.75,80.43 40.75,79.71 41.99,78.47 FPC1.10 FPC2.10
LCD_LEDK: length 11.2
  Top Layer w0.152: 41.89,79.79 41.89,79.04 42.49,78.44 FPC1.11 FPC2.11
LCD_RST: length 36.6
  Top Layer w0.152: U2.12 33.22,46.87 33.97,47.62 v1(37.22,47.62) ; FPC1.2 37.99,52.02 v1(37.19,51.22)
  Bottom Layer w0.152: v1(37.19,51.22) 37.22,51.2 v1(37.22,47.62)
LCD_SCL: length 37.4
  Top Layer w0.152: U2.15 30.72,48.2 31.66,49.14 36.49,49.14 38.99,51.63 FPC1.4
LCD_SDA: length 38.2
  Top Layer w0.152: U2.17 29.72,48.71 31.35,50.33 37.19,50.33 38.49,51.63 FPC1.3
LCD_WR: length 41.8
  Top Layer w0.152: U2.16 30.22,48.44 31.52,49.74 v1(34.99,49.74) ; v1(40.09,52.77) 39.99,52.87 FPC1.6
  Bottom Layer w0.152: v1(34.99,49.74) 35.03,49.79 35.03,53.64 35.41,54.02 38.85,54.02 v1(40.09,52.77)
NRST: length 31.2
  Top Layer w0.152: v1(26.61,45.15) 26.61,44.66 28.72,42.55 v1(31.27,42.55) U2.7 ; v1(39.35,38.14) 43.16,38.14 45.31,40.29 R18.2 ; v1(27.54,48.95) R14.2
  Bottom Layer w0.152: v1(31.27,42.55) 31.27,41.78 34.14,38.9 36.68,38.9 37.45,38.14 v1(39.35,38.14) ; v1(27.54,48.95) 27.54,46.08 v1(26.61,45.15)
OSC_IN: length 7.9
  Top Layer w0.254: X1.3 39,41.82 37.36,41.82 36.55,41.01 36.01,41.55 U2.5
OSC_OUT: length 5.5
  Top Layer w0.254: U2.6 35.93,42.05 36.55,42.66 38.08,42.66 X1.1
SWCLK: length 24.8
  Top Layer w0.152: U2.37 26.22,39.38 v1(26.21,39.4) ; v1(37.66,35.08) 37.66,29.68 39.48,27.85 H1.2
  Bottom Layer w0.152: v1(37.66,35.08) 37,35.08 36.64,34.71 31.29,34.71 26.61,39.4 v1(26.21,39.4)
SWDIO: length 23.8
  Top Layer w0.152: v1(25.97,40.29) 25.71,40.55 U2.34 ; H1.4 39.61,30.39 38.21,31.79 v1(38.21,35.73)
  Bottom Layer w0.152: v1(38.21,35.73) 37.06,35.73 36.3,34.97 31.39,34.97 26.07,40.29 v1(25.97,40.29)
TIM1_CH1: length 70.6
  Top Layer w0.269: v1(45.96,85) 26.27,85 19.28,78.02 19.28,46.14 22.38,43.05 U2.29
  Bottom Layer w0.269: v1(45.96,85) 45.96,82.61 LED6.4
USART1_RX: length 32.8
  Top Layer w0.152: v1(26.59,40.9) 26.59,41.06 25.6,42.05 U2.31 ; v1(38.75,35.06) 38.75,32.4 39.73,31.41 43.16,31.41 44.3,30.27 44.3,28.62 45.07,27.85 H1.1
  Bottom Layer w0.152: v1(38.75,35.06) 38.75,36.21 38.59,36.36 37.19,36.36 36.05,35.22 31.5,35.22 26.59,40.13 v1(26.59,40.9)
USART1_TX: length 31.2
  Top Layer w0.152: U2.30 25.8,42.55 27.27,41.07 v1(27.27,40.36) ; v1(39.3,35.59) 39.35,35.54 39.35,32.43 39.99,31.79 43.67,31.79 45.07,30.39 H1.3
  Bottom Layer w0.152: v1(39.3,35.59) 39.3,36.16 38.72,36.74 37.06,36.74 35.8,35.47 31.6,35.47 27.27,39.8 v1(27.27,40.36)
USB_DM: length 57
  Top Layer w0.142: U2.32 23.83,41.55 23.73,41.44 22.55,41.44 18.23,37.12 18.23,29.68 arc(18.19,29.59) 18.1,29.55 18.07,29.55 arc(17.94,29.43) 18.07,29.3 18.1,29.3 arc(18.23,29.17) 18.1,29.05 18.07,29.05 arc(17.94,28.92) 18.07,28.79 18.1,28.79 arc(18.19,28.76) 18.23,28.67 18.23,16.68 20.52,14.39 37.57,14.39 38,14.82 41.51,14.82 ; USB1.7 41.76,15.41 41.51,15.16 41.51,14.82 ; 41.51,14.82 41.51,14.65 41.75,14.41 USB1.5
USB_DP: length 56.9
  Top Layer w0.142: USB1.6 43.55,14.91 43.8,15.16 43.8,15.65 43.54,15.91 USB1.8 40.24,15.91 R7.2 40.23,15.4 39.94,15.11 37.88,15.11 37.45,14.69 20.64,14.69 18.52,16.81 18.52,37 22.67,41.15 23.73,41.15 23.83,41.05 U2.33
$1N1297: length 8.9
  Bottom Layer w0.254: LED5.4 36.88,82.55 41.88,77.55 LED6.2
$1N1298: length 8.9
  Bottom Layer w0.254: LED5.2 31.88,77.55 26.88,82.55 LED4.4
$1N1299: length 9.6
  Bottom Layer w0.254: LED4.2 19.63,77.55 15.9,81.28 LED3.4
$1N1300: length 8.9
  Bottom Layer w0.254: LED3.2 11.88,77.55 6.88,82.55 LED2.4
$1N1311: length 8.9
  Bottom Layer w0.254: LED11.2 41.88,67.55 36.88,72.55 LED10.4
$1N1312: length 8.9
  Bottom Layer w0.254: LED9.4 26.88,72.55 31.88,67.55 LED10.2
$1N1313: length 8.9
  Bottom Layer w0.254: LED8.4 16.88,72.55 21.88,67.55 LED9.2
$1N1314: length 8.9
  Bottom Layer w0.254: LED7.4 6.88,72.55 11.88,67.55 LED8.2
$1N1325: length 8.9
  Bottom Layer w0.254: LED15.4 36.88,62.55 41.88,57.55 LED16.2
$1N1326: length 8.9
  Bottom Layer w0.254: LED15.2 31.88,57.55 26.88,62.55 LED14.4
$1N1327: length 8.9
  Bottom Layer w0.254: LED13.4 16.88,62.55 21.88,57.55 LED14.2
$1N1328: length 8.9
  Bottom Layer w0.254: LED12.4 6.88,62.55 11.88,57.55 LED13.2
$1N1339: length 8.9
  Bottom Layer w0.254: LED21.2 41.88,47.55 36.88,52.55 LED20.4
$1N1340: length 8.9
  Bottom Layer w0.254: LED19.4 26.88,52.55 31.88,47.55 LED20.2
$1N1341: length 8.9
  Bottom Layer w0.254: LED19.2 21.88,47.55 16.88,52.55 LED18.4
$1N1342: length 8.9
  Bottom Layer w0.254: LED17.4 6.88,52.55 11.88,47.55 LED18.2
$1N2561: length 8.9
  Bottom Layer w0.254: LED39.2 21.88,7.55 16.88,12.55 LED38.4
$1N2563: length 8.9
  Bottom Layer w0.254: LED39.4 26.88,12.55 31.88,7.55 LED40.2
$1N2569: length 8.9
  Bottom Layer w0.254: LED40.4 36.37,12.55 41.37,7.55 LED41.2
$1N2574: length 8.9
  Bottom Layer w0.254: LED24.4 26.88,42.55 31.88,37.55 LED25.2
$1N2575: length 10.3
  Bottom Layer w0.254: LED25.4 36.19,42.55 36.22,42.52 36.22,40.76 36.73,40.25 36.73,39.62 37.32,39.03 40.4,39.03 41.88,37.55 LED26.2
$1N2577: length 8.9
  Bottom Layer w0.254: LED31.2 41.88,27.55 36.88,32.55 LED30.4
$1N2580: length 8.9
  Bottom Layer w0.254: LED30.2 31.88,27.55 26.88,32.55 LED29.4
$1N2582: length 8.9
  Bottom Layer w0.254: LED29.2 21.88,27.55 16.88,32.55 LED28.4
$1N2586: length 8.9
  Bottom Layer w0.254: LED23.4 16.88,42.55 21.88,37.55 LED24.2
$1N2588: length 8.9
  Bottom Layer w0.254: LED32.4 6.88,22.55 11.88,17.55 LED33.2
$1N2592: length 8.9
  Bottom Layer w0.254: LED27.4 6.88,32.55 11.88,27.55 LED28.2
$1N2599: length 9.7
  Bottom Layer w0.254: LED35.4 35.9,21.09 39.44,17.55 LED36.2
$1N2602: length 8.9
  Bottom Layer w0.254: LED33.4 16.88,22.55 21.88,17.55 LED34.2
$1N2608: length 8.9
  Bottom Layer w0.254: LED35.2 31.88,17.55 26.88,22.55 LED34.4
$1N2613: length 8.9
  Bottom Layer w0.254: LED22.4 6.88,42.55 11.88,37.55 LED23.2
$1N2624: length 8.9
  Bottom Layer w0.254: LED37.4 6.88,12.55 11.88,7.55 LED38.2
$1N5287: length 11.6
  Top Layer w0.152: R6.2 36.05,13 40.37,8.68 U1.4 U1.3
$1N5305: length 5.2
  Top Layer w0.508: R11.1 R12.1 R10.1
$1N6451: length 4
  Top Layer w0.152: 29.26,51.21 29.06,51.41 29.06,53.1 SW2.2 ; 29.26,51.21 R14.1 ; 29.26,51.21 29.32,51.16
$1N9042: length 3.3
  Top Layer w0.152: Q1.1 43.03,82.09 43.8,81.31 R24.2 R23.2
$1N12485: length 5.2
  Top Layer w0.28: U4.10 29.69,17.99 C18.2
  Top Layer w0.508: C18.2 26.9,18.93 R15.1
$1N12486: length 6.1
  Top Layer w0.28: U4.9 30.18,18.49 29.83,18.84 29.83,19.73 29.23,20.33 C18.1
  Top Layer w0.508: R19.1 26.9,20.33 C18.1
$1N16092: length 2
  Top Layer w0.381: U3.4 25.15,29.09 C20.2
$1N16325: length 1.8
  Top Layer w0.152: R1.1 U1.2
$1N16327: length 1.7
  Top Layer w0.152: LED1.2 45.1,6.18 R1.2
$1N16424: length 7.5
  Top Layer w0.152: H1.5 46.59,32.93 44.94,34.59 44.94,36.49 46.34,37.89 R18.1
$1N16426: length 17.5
  Top Layer w0.381: R17.2 47.99,37.51 49.13,36.36 49.13,32.17 48.62,31.66 45.45,31.66 44.69,32.43 44.69,33.95 43.16,35.47 H1.8
$1N30459: length 9.5
  Top Layer w0.152: R25.1 40.23,10.85 41.26,9.82 46.46,9.82 46.91,9.37 46.91,8.64
$1N30463: length 10.8
  Top Layer w0.152: R25.2 37.73,12.36 v1(37.71,12.38) ; U1.5 35.93,9.17 35.92,9.19 v1(35.92,9.44)
  Bottom Layer w0.152: v1(37.71,12.38) 37.71,13.24 37.19,13.76 34.91,13.76 34.4,13.25 34.4,10.96 v1(35.92,9.44)

## Copper pours and planes (outline as drawn; the poured copper is in the pictures)
3V3 on Top Layer: 20.99,31.92 23.87,31.92 23.87,28.42 20.99,28.42
3V3 on Top Layer: 29.82,25.5 32.42,25.5 32.42,19.83 29.82,19.83
3V3 on Top Layer: 31.58,39.7 34,39.7 34,35.38 31.58,35.38
3V3 on Inner2: 20.56,80.31 42.02,80.31 42.02,5.88 20.56,5.88
5V on Top Layer: 19.43,25.04 24.04,25.04 24.04,20.47 19.43,20.47
5V on Top Layer: 47.53,42.56 48.46,42.56 48.46,39.85 47.53,39.85
5V on Bottom Layer: 5.27,56.04 16.48,56.04 16.48,54.97 5.27,54.97
5V on Bottom Layer: 5.29,16.04 16.49,16.04 16.49,14.97 5.29,14.97
5V on Bottom Layer: 5.29,76.04 16.49,76.04 16.49,74.97 5.29,74.97
5V on Bottom Layer: 16.87,6.52 21.44,6.52 21.44,5.5 16.87,5.5
5V on Bottom Layer: 5.29,26.04 16.49,26.04 16.49,24.97 5.29,24.97
5V on Bottom Layer: 5.34,46.11 16.54,46.11 16.54,45.05 5.34,45.05
5V on Bottom Layer: 5.27,66.04 16.48,66.04 16.48,64.97 5.27,64.97
5V on Bottom Layer: 47.53,42.66 48.46,42.66 48.46,40.02 47.53,40.02
5V on Bottom Layer: 5.27,36.04 16.48,36.04 16.48,34.97 5.27,34.97
5V on Inner2: 0.26,89.74 49.74,89.74 49.74,0.26 0.26,0.26
5V_VBUS on Top Layer: 25.95,5.2 37.33,5.2 37.33,3.54 25.95,3.54
5V_VBUS on Top Layer: 22.28,18.79 24.06,18.79 24.06,15.21 22.28,15.21
5V_VBUS on Inner2: 20.56,19.35 38.15,19.35 38.15,0.26 20.56,0.26
GND on Top Layer: -11.7,98.59 61.19,98.59 61.19,-6.05 -11.7,-6.05
GND on Bottom Layer: -7,96.18 57.39,96.18 57.39,-4.02 -7,-4.02
GND on Inner1: 0.26,89.74 49.74,89.74 49.74,0.26 0.26,0.26
VBUS on Top Layer: 41.16,19.23 42.44,19.23 42.44,17.28 41.16,17.28
VBUS on Top Layer: 41.12,5.19 45.98,5.19 45.98,3.6 41.12,3.6
VBUS on Top Layer: 41.15,13.03 43.22,13.03 43.22,10.85 41.15,10.85
VBUS on Inner2: 38.66,20.11 49.74,20.11 49.74,0.26 38.66,0.26
BAT on Top Layer: 7.2,13.66 32.24,13.66 32.24,1.86 7.2,1.86
$1N5283 on Top Layer: 40.76,3.52 45.92,3.52 45.92,1.57 40.76,1.57
$1N5290 on Top Layer: 32.75,11.93 36.58,11.93 36.58,6.95 32.75,6.95
$1N5292 on Top Layer: 24.46,7.6 36.57,7.6 36.57,5.51 24.46,5.51

Small or netless copper shapes (teardrops, artwork), in the pictures only: 177 on Top Layer, 247 on Bottom Layer

## Text on the board
Top Silkscreen Layer: BOOT0 | RST | KEY_UP | 5V / GND / DIO / CLK | RST / TX / RX | DC_KEY | ST7789-1.33'' | SWD | STM32F103 / RGB_LCD_V1.0 | @Sparkim
